# Altium schematic sheet Measuring.SchDoc: Voltage Measurer
size 420 x 297 mm; ENG_APP_DATE: --/--/--; DSN_APP_DATE: --/--/--; CHK_APP_DATE: --/--/--; Revision: Cell Balancing
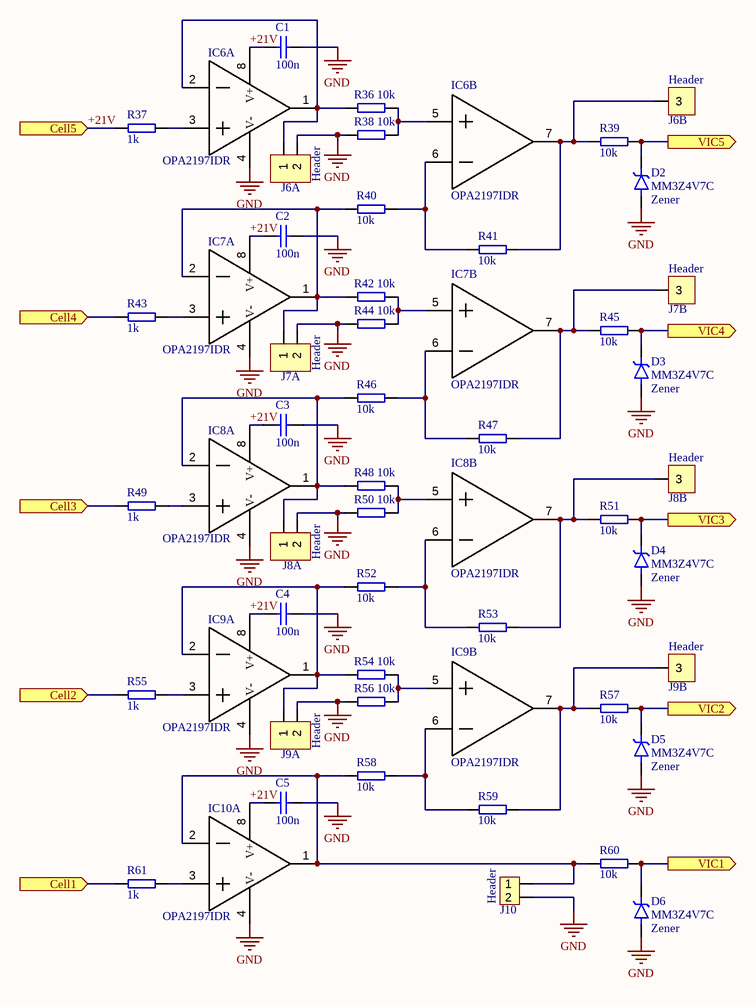
[diagram p0: Measuring.SchDoc]

## Parts
C1  Name: 100n  [C_0805]  (hidden comment: 100nF_35V)
C2  Name: 100n  [C_0805]  (hidden comment: 100nF_35V)
C3  Name: 100n  [C_0805]  (hidden comment: 100nF_35V)
C4  Name: 100n  [C_0805]  (hidden comment: 100nF_35V)
C5  Name: 100n  [C_0805]  (hidden comment: 100nF_35V)
D2  value MM3Z4V7C  Type: Zener  [SODFL2512X90N]  (hidden comment: MM3Z4V7C_SOD-323F)
D3  value MM3Z4V7C  Type: Zener  [SODFL2512X90N]  (hidden comment: MM3Z4V7C_SOD-323F)
D4  value MM3Z4V7C  Type: Zener  [SODFL2512X90N]  (hidden comment: MM3Z4V7C_SOD-323F)
D5  value MM3Z4V7C  Type: Zener  [SODFL2512X90N]  (hidden comment: MM3Z4V7C_SOD-323F)
D6  value MM3Z4V7C  Type: Zener  [SODFL2512X90N]  (hidden comment: MM3Z4V7C_SOD-323F)
IC6  Manufacturer_Part_Number: OPA2197IDR  [SOIC8]  (hidden comment: OPA2197IDR_8-SOIC)  (parts A,B of 2)
IC7  Manufacturer_Part_Number: OPA2197IDR  [SOIC8]  (hidden comment: OPA2197IDR_8-SOIC)  (parts A,B of 2)
IC8  Manufacturer_Part_Number: OPA2197IDR  [SOIC8]  (hidden comment: OPA2197IDR_8-SOIC)  (parts A,B of 2)
IC9  Manufacturer_Part_Number: OPA2197IDR  [SOIC8]  (hidden comment: OPA2197IDR_8-SOIC)  (parts A,B of 2)
IC10  Manufacturer_Part_Number: OPA2197IDR  [SOIC8]  (hidden comment: OPA2197IDR_8-SOIC)  (part A of 2)
J6  Name: Header  [HDR_1X3_2.54mm-MALE]  (hidden comment: 2.54mm pitch)  (parts A,B of 2)
J7  Name: Header  [HDR_1X3_2.54mm-MALE]  (hidden comment: 2.54mm pitch)  (parts A,B of 2)
J8  Name: Header  [HDR_1X3_2.54mm-MALE]  (hidden comment: 2.54mm pitch)  (parts A,B of 2)
J9  Name: Header  [HDR_1X3_2.54mm-MALE]  (hidden comment: 2.54mm pitch)  (parts A,B of 2)
J10  Name: Header  [HDR_1x2_2.54mm-MALE]  (hidden comment: 2.54mm pitch)
R36  Name: 10k  [R_0805]  (hidden comment: 10k_125mW)
R37  Name: 1k  [R_0805]  (hidden comment: 1k_125mW)
R38  Name: 10k  [R_0805]  (hidden comment: 10k_125mW)
R39  Name: 10k  [R_0805]  (hidden comment: 10k_125mW)
R40  Name: 10k  [R_0805]  (hidden comment: 10k_125mW)
R41  Name: 10k  [R_0805]  (hidden comment: 10k_125mW)
R42  Name: 10k  [R_0805]  (hidden comment: 10k_125mW)
R43  Name: 1k  [R_0805]  (hidden comment: 1k_125mW)
R44  Name: 10k  [R_0805]  (hidden comment: 10k_125mW)
R45  Name: 10k  [R_0805]  (hidden comment: 10k_125mW)
R46  Name: 10k  [R_0805]  (hidden comment: 10k_125mW)
R47  Name: 10k  [R_0805]  (hidden comment: 10k_125mW)
R48  Name: 10k  [R_0805]  (hidden comment: 10k_125mW)
R49  Name: 1k  [R_0805]  (hidden comment: 1k_125mW)
R50  Name: 10k  [R_0805]  (hidden comment: 10k_125mW)
R51  Name: 10k  [R_0805]  (hidden comment: 10k_125mW)
R52  Name: 10k  [R_0805]  (hidden comment: 10k_125mW)
R53  Name: 10k  [R_0805]  (hidden comment: 10k_125mW)
R54  Name: 10k  [R_0805]  (hidden comment: 10k_125mW)
R55  Name: 1k  [R_0805]  (hidden comment: 1k_125mW)
R56  Name: 10k  [R_0805]  (hidden comment: 10k_125mW)
R57  Name: 10k  [R_0805]  (hidden comment: 10k_125mW)
R58  Name: 10k  [R_0805]  (hidden comment: 10k_125mW)
R59  Name: 10k  [R_0805]  (hidden comment: 10k_125mW)
R60  Name: 10k  [R_0805]  (hidden comment: 10k_125mW)
R61  Name: 1k  [R_0805]  (hidden comment: 1k_125mW)

## Ports
Cell1 (in), Cell2 (in), Cell3 (in), Cell4 (in), Cell5 (in), VIC1 (out), VIC2 (out), VIC3 (out), VIC4 (out), VIC5 (out)

## Nets
GND: C1.1 C2.1 C3.1 C4.1 C5.1 D2.A D3.A D4.A D5.A D6.A IC6.4(V-) IC7.4(V-) IC8.4(V-) IC9.4(V-) IC10.4(V-) J6.2 J7.2 J8.2 J9.2 J10.2 R38.2 R44.2 R50.2 R56.2
+21V: C1.2 C2.2 C3.2 C4.2 C5.2 IC6.8(V+) IC7.8(V+) IC8.8(V+) IC9.8(V+) IC10.8(V+) R37.2 ; port Cell5
Cell1: R61.2 ; port Cell1
Cell2: R55.2 ; port Cell2
Cell3: R49.2 ; port Cell3
Cell4: R43.2 ; port Cell4
VIC1: D6.K R60.1 ; port VIC1
VIC2: D5.K R57.1 ; port VIC2
VIC3: D4.K R51.1 ; port VIC3
VIC4: D3.K R45.1 ; port VIC4
VIC5: D2.K R39.1 ; port VIC5
NetIC6_1: IC6.1(OUT_A) IC6.2(-IN_A) J6.1 R36.2
NetIC6_3: IC6.3(+IN_A) R37.1
NetIC6_5: IC6.5(+IN_B) R36.1 R38.1
NetIC6_6: IC6.6(-IN_B) R40.1 R41.2
NetIC6_7: IC6.7(OUT_B) J6.3 R39.2 R41.1
NetIC7_1: IC7.1(OUT_A) IC7.2(-IN_A) J7.1 R40.2 R42.2
NetIC7_3: IC7.3(+IN_A) R43.1
NetIC7_5: IC7.5(+IN_B) R42.1 R44.1
NetIC7_6: IC7.6(-IN_B) R46.1 R47.2
NetIC7_7: IC7.7(OUT_B) J7.3 R45.2 R47.1
NetIC8_1: IC8.1(OUT_A) IC8.2(-IN_A) J8.1 R46.2 R48.2
NetIC8_3: IC8.3(+IN_A) R49.1
NetIC8_5: IC8.5(+IN_B) R48.1 R50.1
NetIC8_6: IC8.6(-IN_B) R52.1 R53.2
NetIC8_7: IC8.7(OUT_B) J8.3 R51.2 R53.1
NetIC9_1: IC9.1(OUT_A) IC9.2(-IN_A) J9.1 R52.2 R54.2
NetIC9_3: IC9.3(+IN_A) R55.1
NetIC9_5: IC9.5(+IN_B) R54.1 R56.1
NetIC9_6: IC9.6(-IN_B) R58.1 R59.2
NetIC9_7: IC9.7(OUT_B) J9.3 R57.2 R59.1
NetIC10_1: IC10.1(OUT_A) IC10.2(-IN_A) J10.1 R58.2 R60.2
NetIC10_3: IC10.3(+IN_A) R61.1

## Notes on the sheet
- THIS DOCUMENT AND THE DATA DISCLOSED HEREIN OR
- HEREWITH IS THE PROPERTY OF ALTIUM LIMITED AND MAY
- DWG NO:
- REVISION
- REV:
- DESCRIPTION
- DATE
- APPROVED
- BE FREELY DISTRIBUTED IN WHOLE. NO RIGHTS ARE
- RESERVED OR EXPRESS OR IMPLIED WARANTEE GIVEN.
- ENG:
- APPROVALS
- PROJECT
- DSN:
- CHK:
- REFERENCE DOCUMENTS
- PROJECT REVISION:
- TITLE
- DOCUMENT REVISION:
- DESIGN ITEM:
- BOM:
- FAB DWG:
- PCB DWG:
- ASSY DWG:
- SCALE:
- A3
- SIZE
- CAGE CODE
- FILE NAME
- DWG NO.
- SHEET
- OF
- REV

## Library data of the parts
C1-C5 = C_100nF_0805: Capacitor [SMD]; Manufacturer: Murata; Manufacturer Part Number: GCJ21BL81H104KA01L; Capacitance: 100nF; Tolerance: 10%; Voltage Rating: 50V; ComponentLink1Description: DATASHEET; ComponentLink1URL: https://hr.mouser.com/datasheet/2/281/GCJ21BL81H104KA01_01-1963909.pdf; ComponentLink2Description: BUY; ComponentLink2URL: https://hr.mouser.com/ProductDetail/Murata-Electronics/GCJ21BL81H104KA01L?qs=QzBtWTOodeX5ICEuC%252Bh33g%3D%3D; Supplier 1: Mouser; Supplier Part Number 1: 81-GCJ21BL81H104KA1L; Case Code (Imperial): 0805; Case Code (Metric): 2012; Case/Package: 0805; Features: Soft Termination; Max Operating Temperature: 150°C; Min Operating Temperature: -55°C; Mount: Surface Mount; Packaging: Tape and Reel; Ratings: AEC-Q200; RoHS Compliant: Yes; Supplier Packaging 1: Tape & Reel; Supplier Unit Price 1: $0.30; Supplier Location 1: US
D2-D6 = MM3Z4V7C_SOD-323F: Zener Single Diode, 4.7 V, 200 mW [SMD]; Manufacturer: ON Semiconductor / Fairchild; MP: 1N4148WS; MF: ON Semiconductor; Forward Voltage: 1V; Impedance: 75R; Max Power Dissipation: 200mW; Max Reverse Current: 2.7uA; Test Current: 5mA; Tolerance: 5%; Working Voltage: 4.7V; Price: None; SnapEDA_Link: https://www.snapeda.com/parts/1N4148WS/ON%20Semiconductor/view-part/2747266/?ref=snap; Availability: Good; Package: SOD-323FL-2 ON Semiconductor; ComponentLink1Description: DATASHEET; ComponentLink1URL: https://hr.mouser.com/datasheet/2/308/1/MM3Z9V1C_D-2315854.pdf; ComponentLink2Description: BUY; ComponentLink2URL: https://hr.mouser.com/ProductDetail/onsemi-Fairchild/MM3Z4V7C?qs=sGAEpiMZZMtdo5lL%2F%252BX2BwKAOpX0rFyD; Check_prices: https://www.snapeda.com/parts/1N4148WS/ON%20Semiconductor/view-part/2747266/?ref=eda; Purchase-URL: https://pricing.snapeda.com/search/part/1N4148WS/?ref=eda; Supplier 1: Mouser; Supplier Part Number 1: 512-MM3Z4V7C; Element Configuration: Single; Height: 1mm; Lead Free: Lead Free; Length: 1.3mm; Max Operating Temperature: 150°C; Max Reverse Leakage Current: 2.7uA; Min Operating Temperature: -65°C; Mount: Surface Mount; Number of Pins: 2; Package Quantity: 1; Packaging: Tape and Reel; Power Dissipation: 200mW; Radiation Hardening: No; RoHS Compliant: Yes; Voltage Tolerance: 5%; Weight: 0.0276g; Width: 1.7mm; Zener Voltage: 4.7V; Supplier Packaging 1: Tape & Reel; Supplier Unit Price 1: $0.24; Supplier Location 1: US; Manufacturer Part Number: MM3Z4V7C; Case/Package: SOD−323FL
IC6-IC10 = OPA2197IDR_8-SOIC: Dual OP AMP [TH]; Manufacturer_Name: Texas Instruments; Bandwidth: 10MHz; Input Bias Current: 5pA; Input Offset Voltage (Vos): 250uV; Number of Amplifiers: 2; Operating Supply Current: 1mA; Output Current per Channel: 65mA; Slew Rate: 20V/µs; Datasheet Link: https://componentsearchengine.com/Datasheets/2/OPA2197IDR.pdf; Height: 1.75mm; Mouser Part Number: 595-OPA2197IDR; Mouser Price/Stock: https://www.mouser.com/Search/Refine.aspx?Keyword=595-OPA2197IDR; ComponentLink1Description: DATASHEET; ComponentLink1URL: https://www.ti.com/lit/ds/symlink/opa2197.pdf?HQS=dis-mous-null-mousermode-dsf-pf-null-wwe&ts=1646121857740&ref_url=https%253A%252F%252Fwww.mouser.de%252F; ComponentLink2Description: BUY; ComponentLink2URL: https://hr.mouser.com/ProductDetail/Texas-Instruments/OPA2197IDR?qs=LuYMPh7GGMTV7Fo%252BZRgbTw%3D%3D; Supplier 1: Mouser; Supplier Part Number 1: 595-OPA2197IDR; Case/Package: SOIC-8; Gain Bandwidth Product: 10MHz; Lead Free: Lead Free; Max Operating Temperature: 125°C; Min Operating Temperature: -40°C; Mount: Surface Mount; Number of Channels: 2; Number of Circuits: 2; Number of Pins: 8; Packaging: Cut Tape; REACH SVHC: No SVHC; RoHS Compliant: Yes; Supplier Packaging 1: Tape & Reel; Supplier Unit Price 1: $2.72; Supplier Location 1: US; Manufacturer: Texas Instruments; Manufacturer Part Number: OPA2197IDR
J6-J9 = Header 1x3AB: Header, 3-Pin [TH]; Manufacturer: Molex; Connector Type: Male Pin; Current Rating: 4A; Gender: Male; Glow Wire Compliant: Non-compliant; Number of Circuits: 15; Pitch: 0.1inch; Voltage Rating: 250V; LatestRevisionDate: 17-Jul-2002; LatestRevisionNote: Re-released for DXP Platform.; Publisher: Altium Limited; ComponentLink1Description: DATASHEET; ComponentLink1URL: https://hr.mouser.com/datasheet/2/276/0022284150_PCB_HEADERS-159054.pdf; ComponentLink2Description: BUY; ComponentLink2URL: https://hr.mouser.com/ProductDetail/Molex/22-28-4150?qs=M5Ic86%252BuP8aClMFgmZrq7g%3D%3D; Supplier 1: Mouser; Supplier Part Number 1: 538-22-28-4150; Color: Black; Contact Material: Brass; Contact Mating Length: 0.24inch; Contact Plating: Tin; Contact Type: Male Pin; Flammability Rating: UL94 V-0; Height: 2.29mm; Housing Color: Black; Housing Material: Thermoplastic; Lead Free: Contains Lead; Length: 38.1mm; Mount: Through Hole; Number of Contacts: 15; Number of Positions: 15; Number of Rows: 1; Orientation: Vertical; Package Quantity: 1; Packaging: Bulk; RoHS Compliant: Yes; Series: KK® 42375; Termination: Solder; Voltage Rating (DC): 250V; Width: 2.49mm; Supplier Packaging 1: Bulk; Supplier Unit Price 1: $0.57; Supplier Location 1: US; Manufacturer Part Number: 22-28-4150
J10 = Header 1x2: Header, 2-Pin [TH]; Manufacturer: Molex; Current Rating: 4A; Gender: Male; Glow Wire Compliant: Non-compliant; Number of Circuits: 15; Pitch: 0.1inch; Voltage Rating: 250V; Connector Type: Male Pin; LatestRevisionDate: 17-Jul-2002; LatestRevisionNote: Re-released for DXP Platform.; Publisher: Altium Limited; ComponentLink1Description: DATASHEET; ComponentLink1URL: https://hr.mouser.com/datasheet/2/276/0022284150_PCB_HEADERS-159054.pdf; ComponentLink2Description: BUY; ComponentLink2URL: https://hr.mouser.com/ProductDetail/Molex/22-28-4150?qs=M5Ic86%252BuP8aClMFgmZrq7g%3D%3D; Supplier 1: Mouser; Supplier Part Number 1: 538-22-28-4150; Color: Black; Contact Material: Brass; Contact Mating Length: 0.24inch; Contact Plating: Tin; Contact Type: Male Pin; Flammability Rating: UL94 V-0; Height: 2.29mm; Housing Color: Black; Housing Material: Thermoplastic; Lead Free: Contains Lead; Length: 38.1mm; Mount: Through Hole; Number of Contacts: 15; Number of Positions: 15; Number of Rows: 1; Orientation: Vertical; Package Quantity: 1; Packaging: Bulk; RoHS Compliant: Yes; Series: KK® 42375; Termination: Solder; Voltage Rating (DC): 250V; Width: 2.49mm; Supplier Packaging 1: Bulk; Supplier Unit Price 1: $0.57; Supplier Location 1: US; Manufacturer Part Number: 22-28-4150
R36 R38-R42 R44-R48 R50-R54 R56-R60 = R_10k_0805: Resistor [SMD]; Manufacturer: Vishay; Manufacturer Part Number: CRCW080510K0FKEAC; Power Rating: 125mW; Resistance: 10000R; Tolerance: 1%; ComponentLink1Description: DATASHEET; ComponentLink1URL: https://hr.mouser.com/datasheet/2/427/crcwce3-1762584.pdf; ComponentLink2Description: BUY; ComponentLink2URL: https://hr.mouser.com/ProductDetail/Vishay-Dale/CRCW080510K0FKEAC?qs=E3Y5ESvWgWORadmUijPtxQ%3D%3D; Supplier 1: Mouser; Supplier Part Number 1: 71-CRCW080510K0FKEAC; Case/Package: 0805; Lead Free: Lead Free; RoHS Compliant: Yes; Supplier Packaging 1: Tape & Reel; Supplier Unit Price 1: $0.10; Supplier Location 1: US
R37 R43 R49 R55 R61 = R_1k_0805: Resistor [SMD]; Manufacturer: Vishay; Manufacturer Part Number: CRCW08051K00FKEAC; Max Power Dissipation: 125mW; Resistance: 1kR; Temperature Coefficient: 100ppm/°C; Tolerance: 1%; Voltage Rating: 150V; ComponentLink1Description: DATASHEET; ComponentLink1URL: https://www.mouser.com/datasheet/2/427/crcwce3-1762584.pdf; ComponentLink2Description: BUY; ComponentLink2URL: https://www.mouser.com/ProductDetail/Vishay-Dale/CRCW08051K00FKEAC?qs=CZ6xfwOSLTXmQIgaYvN%2FBA%3D%3D; Supplier 1: Mouser; Supplier Part Number 1: 71-CRCW08051K00FKEAC; Case Code (Imperial): 0805; Case Code (Metric): 2012; Case/Package: 0805; Contact Plating: Tin; Features: Automotive AEC-Q200,Anti-Sulfur; Height: 0.02inch; Length: 2mm; Max Operating Temperature: 155°C; Min Operating Temperature: -55°C; Number of Terminations: 2; Package Quantity: 5000; Packaging: Tape and Reel; Power Rating: 125mW; Radiation Hardening: No; Resistor Type: Thick Film; RoHS Compliant: Yes; Series: RCA; Termination: Wraparound; Width: 0.049inch; Supplier Packaging 1: Tape & Reel; Supplier Unit Price 1: $0.12; Supplier Location 1: US; Lead Free: Lead Free; Mount: Surface Mount